# EAGLE design smdpractice_ledmarquee (EAGLE 5.11)
PROJECT: LED MARQUEE BOARD v1.0
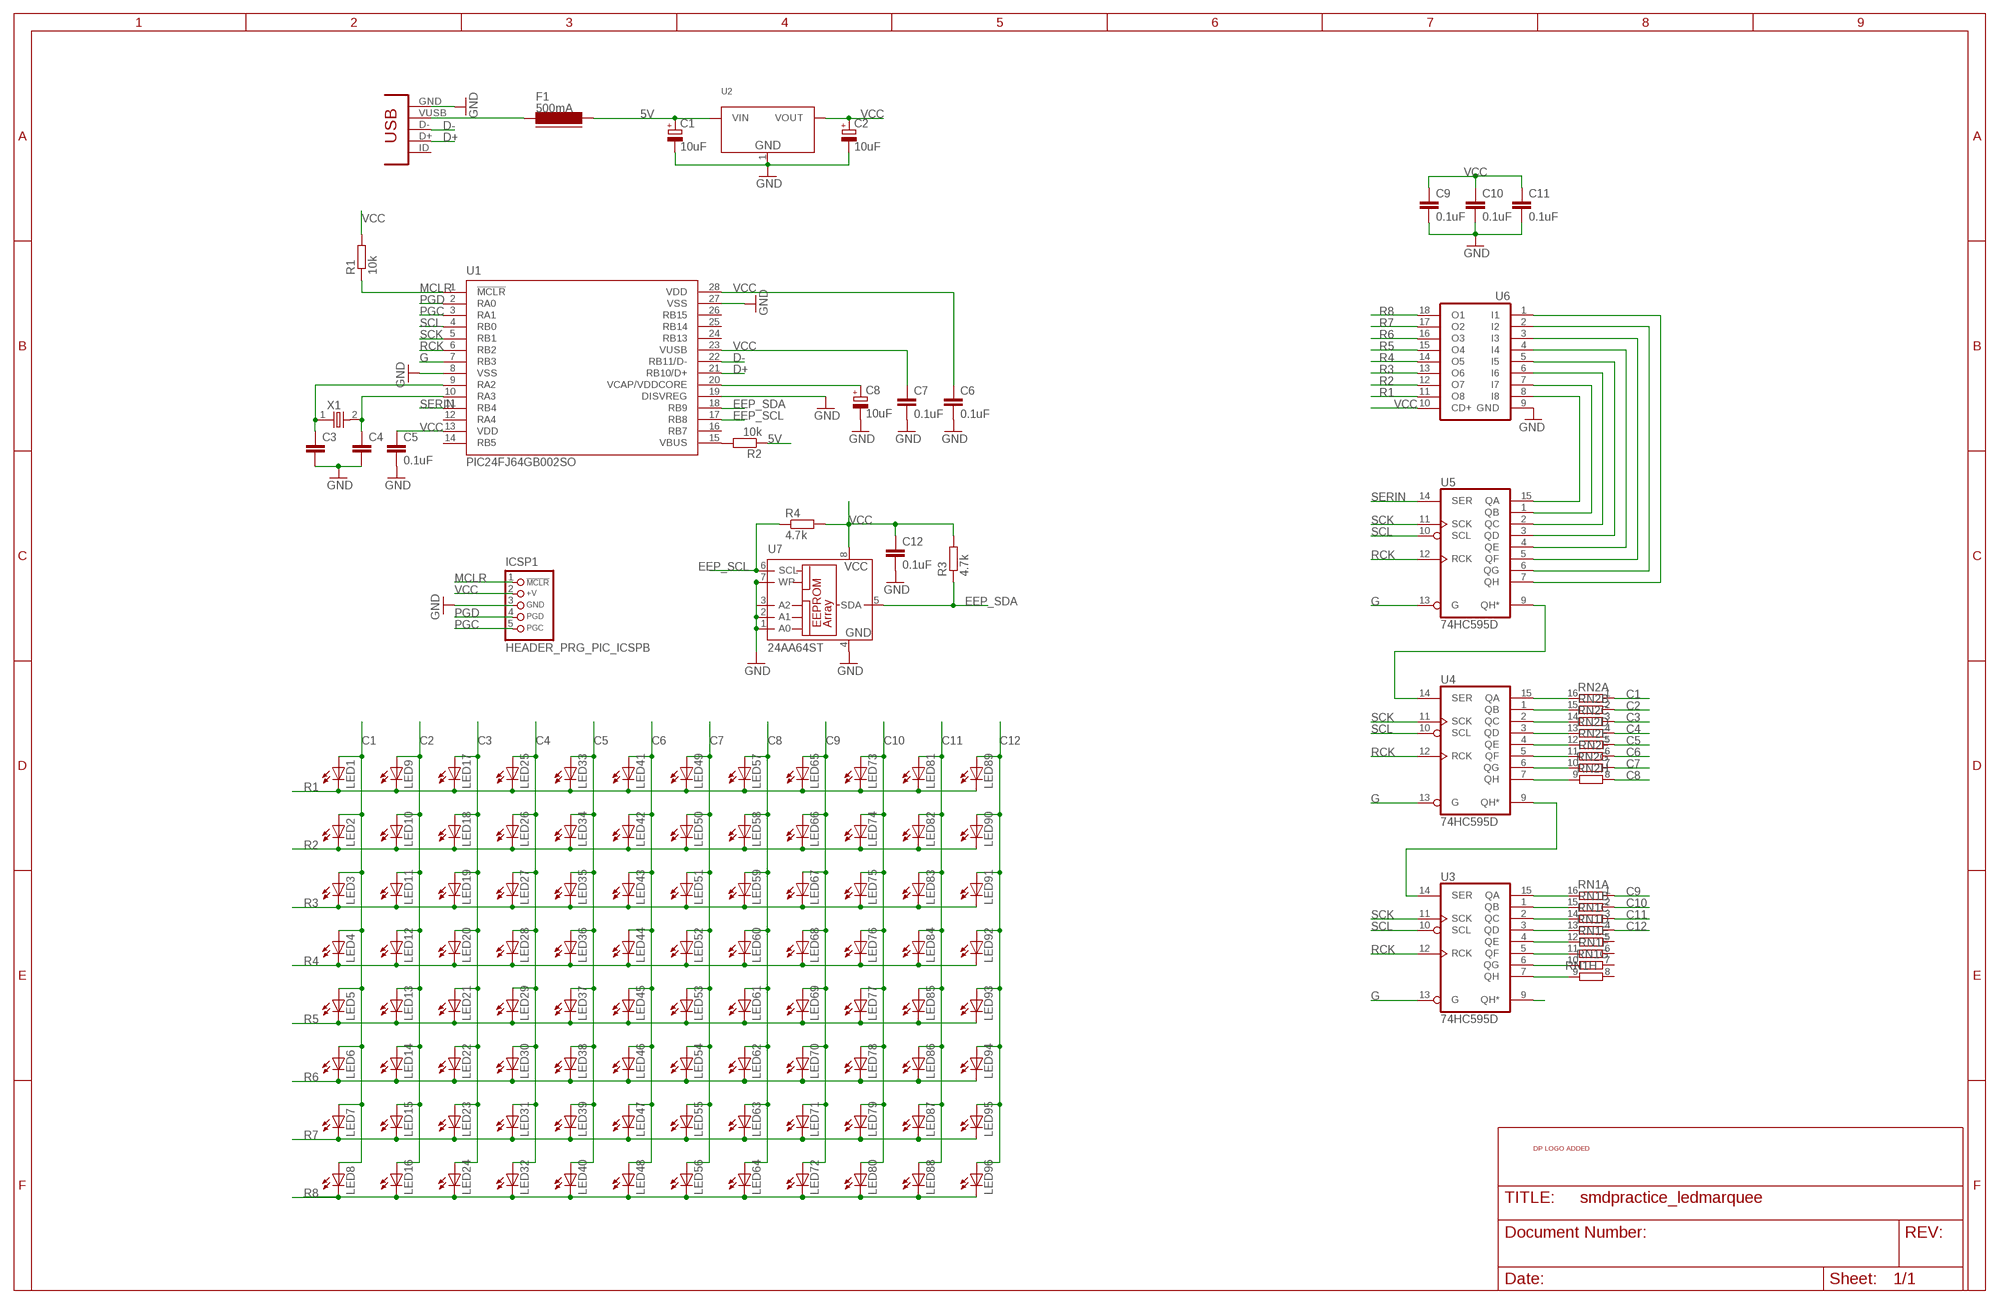
[diagram p0: schematic, sheet 1]

## Parts
C1  10uF  CAP_POLSMC_A  [SMC_A]
C2  10uF  CAP_POLSMC_A  [SMC_A]
C3  CAPC1206  [C1206]
C4  CAPC1206  [C1206]
C5  0.1uF  CAPC1206  [C1206]
C6  0.1uF  CAPC1206  [C1206]
C7  0.1uF  CAPC1206  [C1206]
C8  10uF  CAP_POLSMC_A  [SMC_A]
C9  0.1uF  CAPC1206  [C1206]
C10  0.1uF  CAPC1206  [C1206]
C11  0.1uF  CAPC1206  [C1206]
C12  0.1uF  CAPC1206  [C1206]
F1  500mA  FERRITE_BEAD1206  [FB1206]
ICSP1  HEADER_PRG_PIC_ICSPB  [HEADER_PRG_1X05_ICSP_B]
J1  CON-USB-MINI-BUSB1  [CONN_USB_MINI-B]
LED1  LEDCHIPLED_1206  [CHIPLED_1206]
LED2  LEDCHIPLED_1206  [CHIPLED_1206]
LED3  LEDCHIPLED_1206  [CHIPLED_1206]
LED4  LEDCHIPLED_1206  [CHIPLED_1206]
LED5  LEDCHIPLED_1206  [CHIPLED_1206]
LED6  LEDCHIPLED_1206  [CHIPLED_1206]
LED7  LEDCHIPLED_1206  [CHIPLED_1206]
LED8  LEDCHIPLED_1206  [CHIPLED_1206]
LED9  LEDCHIPLED_1206  [CHIPLED_1206]
LED10  LEDCHIPLED_1206  [CHIPLED_1206]
LED11  LEDCHIPLED_1206  [CHIPLED_1206]
LED12  LEDCHIPLED_1206  [CHIPLED_1206]
LED13  LEDCHIPLED_1206  [CHIPLED_1206]
LED14  LEDCHIPLED_1206  [CHIPLED_1206]
LED15  LEDCHIPLED_1206  [CHIPLED_1206]
LED16  LEDCHIPLED_1206  [CHIPLED_1206]
LED17  LEDCHIPLED_1206  [CHIPLED_1206]
LED18  LEDCHIPLED_1206  [CHIPLED_1206]
LED19  LEDCHIPLED_1206  [CHIPLED_1206]
LED20  LEDCHIPLED_1206  [CHIPLED_1206]
LED21  LEDCHIPLED_1206  [CHIPLED_1206]
LED22  LEDCHIPLED_1206  [CHIPLED_1206]
LED23  LEDCHIPLED_1206  [CHIPLED_1206]
LED24  LEDCHIPLED_1206  [CHIPLED_1206]
LED25  LEDCHIPLED_1206  [CHIPLED_1206]
LED26  LEDCHIPLED_1206  [CHIPLED_1206]
LED27  LEDCHIPLED_1206  [CHIPLED_1206]
LED28  LEDCHIPLED_1206  [CHIPLED_1206]
LED29  LEDCHIPLED_1206  [CHIPLED_1206]
LED30  LEDCHIPLED_1206  [CHIPLED_1206]
LED31  LEDCHIPLED_1206  [CHIPLED_1206]
LED32  LEDCHIPLED_1206  [CHIPLED_1206]
LED33  LEDCHIPLED_1206  [CHIPLED_1206]
LED34  LEDCHIPLED_1206  [CHIPLED_1206]
LED35  LEDCHIPLED_1206  [CHIPLED_1206]
LED36  LEDCHIPLED_1206  [CHIPLED_1206]
LED37  LEDCHIPLED_1206  [CHIPLED_1206]
LED38  LEDCHIPLED_1206  [CHIPLED_1206]
LED39  LEDCHIPLED_1206  [CHIPLED_1206]
LED40  LEDCHIPLED_1206  [CHIPLED_1206]
LED41  LEDCHIPLED_1206  [CHIPLED_1206]
LED42  LEDCHIPLED_1206  [CHIPLED_1206]
LED43  LEDCHIPLED_1206  [CHIPLED_1206]
LED44  LEDCHIPLED_1206  [CHIPLED_1206]
LED45  LEDCHIPLED_1206  [CHIPLED_1206]
LED46  LEDCHIPLED_1206  [CHIPLED_1206]
LED47  LEDCHIPLED_1206  [CHIPLED_1206]
LED48  LEDCHIPLED_1206  [CHIPLED_1206]
LED49  LEDCHIPLED_1206  [CHIPLED_1206]
LED50  LEDCHIPLED_1206  [CHIPLED_1206]
LED51  LEDCHIPLED_1206  [CHIPLED_1206]
LED52  LEDCHIPLED_1206  [CHIPLED_1206]
LED53  LEDCHIPLED_1206  [CHIPLED_1206]
LED54  LEDCHIPLED_1206  [CHIPLED_1206]
LED55  LEDCHIPLED_1206  [CHIPLED_1206]
LED56  LEDCHIPLED_1206  [CHIPLED_1206]
LED57  LEDCHIPLED_1206  [CHIPLED_1206]
LED58  LEDCHIPLED_1206  [CHIPLED_1206]
LED59  LEDCHIPLED_1206  [CHIPLED_1206]
LED60  LEDCHIPLED_1206  [CHIPLED_1206]
LED61  LEDCHIPLED_1206  [CHIPLED_1206]
LED62  LEDCHIPLED_1206  [CHIPLED_1206]
LED63  LEDCHIPLED_1206  [CHIPLED_1206]
LED64  LEDCHIPLED_1206  [CHIPLED_1206]
LED65  LEDCHIPLED_1206  [CHIPLED_1206]
LED66  LEDCHIPLED_1206  [CHIPLED_1206]
LED67  LEDCHIPLED_1206  [CHIPLED_1206]
LED68  LEDCHIPLED_1206  [CHIPLED_1206]
LED69  LEDCHIPLED_1206  [CHIPLED_1206]
LED70  LEDCHIPLED_1206  [CHIPLED_1206]
LED71  LEDCHIPLED_1206  [CHIPLED_1206]
LED72  LEDCHIPLED_1206  [CHIPLED_1206]
LED73  LEDCHIPLED_1206  [CHIPLED_1206]
LED74  LEDCHIPLED_1206  [CHIPLED_1206]
LED75  LEDCHIPLED_1206  [CHIPLED_1206]
LED76  LEDCHIPLED_1206  [CHIPLED_1206]
LED77  LEDCHIPLED_1206  [CHIPLED_1206]
LED78  LEDCHIPLED_1206  [CHIPLED_1206]
LED79  LEDCHIPLED_1206  [CHIPLED_1206]
LED80  LEDCHIPLED_1206  [CHIPLED_1206]
LED81  LEDCHIPLED_1206  [CHIPLED_1206]
LED82  LEDCHIPLED_1206  [CHIPLED_1206]
LED83  LEDCHIPLED_1206  [CHIPLED_1206]
LED84  LEDCHIPLED_1206  [CHIPLED_1206]
LED85  LEDCHIPLED_1206  [CHIPLED_1206]
LED86  LEDCHIPLED_1206  [CHIPLED_1206]
LED87  LEDCHIPLED_1206  [CHIPLED_1206]
LED88  LEDCHIPLED_1206  [CHIPLED_1206]
LED89  LEDCHIPLED_1206  [CHIPLED_1206]
LED90  LEDCHIPLED_1206  [CHIPLED_1206]
LED91  LEDCHIPLED_1206  [CHIPLED_1206]
LED92  LEDCHIPLED_1206  [CHIPLED_1206]
LED93  LEDCHIPLED_1206  [CHIPLED_1206]
LED94  LEDCHIPLED_1206  [CHIPLED_1206]
LED95  LEDCHIPLED_1206  [CHIPLED_1206]
LED96  LEDCHIPLED_1206  [CHIPLED_1206]
R1  10k  RESISTORR1206  [R1206]
R2  10k  RESISTORR1206  [R1206]
R3  4.7k  RESISTORR1206  [R1206]
R4  4.7k  RESISTORR1206  [R1206]
RN1  470  RNETWORK_8  [CAT16-F8/CAT16-J8]
RN2  470  RNETWORK_8  [CAT16-F8/CAT16-J8]
U1  PIC24FJ64GB002SO  [SOIC28W]
U2  LD1117-3.3SOT223  [SOT223]
U3  74HC595D  [SO16]
U4  74HC595D  [SO16]
U5  74HC595D  [SO16]
U6  ULN2803ADW  [SO18L]
U7  24AA64ST  [TSSOP8]
U$1  DP_LOGO  [DP_LOGO]
X1  OSC-XTAL  [HC-49U]

## Nets
5V: C1.+ F1.2 R2.1 U2.3(VIN)
C1: LED1.A LED2.A LED3.A LED4.A LED5.A LED6.A LED7.A LED8.A RN2.1
C2: LED9.A LED10.A LED11.A LED12.A LED13.A LED14.A LED15.A LED16.A RN2.2
C3: LED17.A LED18.A LED19.A LED20.A LED21.A LED22.A LED23.A LED24.A RN2.3
C4: LED25.A LED26.A LED27.A LED28.A LED29.A LED30.A LED31.A LED32.A RN2.4
C5: LED33.A LED34.A LED35.A LED36.A LED37.A LED38.A LED39.A LED40.A RN2.5
C6: LED41.A LED42.A LED43.A LED44.A LED45.A LED46.A LED47.A LED48.A RN2.6
C7: LED49.A LED50.A LED51.A LED52.A LED53.A LED54.A LED55.A LED56.A RN2.7
C8: LED57.A LED58.A LED59.A LED60.A LED61.A LED62.A LED63.A LED64.A RN2.8
C9: LED65.A LED66.A LED67.A LED68.A LED69.A LED70.A LED71.A LED72.A RN1.1
C10: LED73.A LED74.A LED75.A LED76.A LED77.A LED78.A LED79.A LED80.A RN1.2
C11: LED81.A LED82.A LED83.A LED84.A LED85.A LED86.A LED87.A LED88.A RN1.3
C12: LED89.A LED90.A LED91.A LED92.A LED93.A LED94.A LED95.A LED96.A RN1.4
D+: J1.D+ U1.21(RB10/D+)
D-: J1.D- U1.22(RB11/D-)
EEP_SCL: R4.1 U1.17(RB8) U7.6(SCL)
EEP_SDA: R3.1 U1.18(RB9) U7.5(SDA)
G: U1.7(RB3) U3.13(G) U4.13(G) U5.13(G)
GND: C1.- C2.- C3.2 C4.2 C5.2 C6.2 C7.2 C8.- C9.2 C10.2 C11.2 C12.2 ICSP1.3(GND) J1.GND U1.8(VSS) U1.19(DISVREG) U1.27(VSS) U2.1(GND) U6.9(GND) U7.1(A0) U7.2(A1) U7.3(A2) U7.4(GND) U7.7(WP)
MCLR: ICSP1.1(/MCLR) R1.1 U1.1(!MCLR)
N$1: RN1.16 U3.15(QA)
N$2: RN1.15 U3.1(QB)
N$3: RN1.14 U3.2(QC)
N$4: RN1.13 U3.3(QD)
N$5: RN1.12 U3.4(QE)
N$6: RN1.11 U3.5(QF)
N$7: RN1.10 U3.6(QG)
N$8: RN1.9 U3.7(QH)
N$9: RN2.16 U4.15(QA)
N$10: RN2.15 U4.1(QB)
N$11: RN2.14 U4.2(QC)
N$12: RN2.13 U4.3(QD)
N$13: RN2.12 U4.4(QE)
N$14: RN2.11 U4.5(QF)
N$15: RN2.10 U4.6(QG)
N$16: RN2.9 U4.7(QH)
N$17: U4.14(SER) U5.9(QH*)
N$18: C3.1 U1.9(RA2) X1.1
N$19: C4.1 U1.10(RA3) X1.2
N$20: U3.14(SER) U4.9(QH*)
N$21: R2.2 U1.15(VBUS)
N$22: C8.+ U1.20(VCAP/VDDCORE)
N$23: F1.1 J1.VUSB
N$25: U3.9(QH*)
N$40: U5.15(QA) U6.8(I8)
N$41: U5.1(QB) U6.7(I7)
N$42: U5.2(QC) U6.6(I6)
N$45: U5.5(QF) U6.3(I3)
N$46: U5.6(QG) U6.2(I2)
N$47: U5.7(QH) U6.1(I1)
N$51: U5.4(QE) U6.4(I4)
N$52: U5.3(QD) U6.5(I5)
PGC: ICSP1.5(PGC) U1.3(RA1)
PGD: ICSP1.4(PGD) U1.2(RA0)
R1: LED1.C LED9.C LED17.C LED25.C LED33.C LED41.C LED49.C LED57.C LED65.C LED73.C LED81.C LED89.C U6.11(O8)
R2: LED2.C LED10.C LED18.C LED26.C LED34.C LED42.C LED50.C LED58.C LED66.C LED74.C LED82.C LED90.C U6.12(O7)
R3: LED3.C LED11.C LED19.C LED27.C LED35.C LED43.C LED51.C LED59.C LED67.C LED75.C LED83.C LED91.C U6.13(O6)
R4: LED4.C LED12.C LED20.C LED28.C LED36.C LED44.C LED52.C LED60.C LED68.C LED76.C LED84.C LED92.C U6.14(O5)
R5: LED5.C LED13.C LED21.C LED29.C LED37.C LED45.C LED53.C LED61.C LED69.C LED77.C LED85.C LED93.C U6.15(O4)
R6: LED6.C LED14.C LED22.C LED30.C LED38.C LED46.C LED54.C LED62.C LED70.C LED78.C LED86.C LED94.C U6.16(O3)
R7: LED7.C LED15.C LED23.C LED31.C LED39.C LED47.C LED55.C LED63.C LED71.C LED79.C LED87.C LED95.C U6.17(O2)
R8: LED8.C LED16.C LED24.C LED32.C LED40.C LED48.C LED56.C LED64.C LED72.C LED80.C LED88.C LED96.C U6.18(O1)
RCK: U1.6(RB2) U3.12(RCK) U4.12(RCK) U5.12(RCK)
SCK: U1.5(RB1) U3.11(SCK) U4.11(SCK) U5.11(SCK)
SCL: U1.4(RB0) U3.10(SCL) U4.10(SCL) U5.10(SCL)
SERIN: U1.11(RB4) U5.14(SER)
VCC: C2.+ C5.1 C6.1 C7.1 C9.1 C10.1 C11.1 C12.1 ICSP1.2(+V) R1.2 R3.2 R4.2 U1.13(VDD) U1.23(VUSB) U1.28(VDD) U2.2(VOUT) U6.10(CD+) U7.8(VCC)
Unconnected: J1.BODY@1(BODY) J1.BODY@2(BODY) J1.BODY@3(BODY) J1.BODY@4(BODY) J1.ID(USBID) RN1.5 RN1.6 RN1.7 RN1.8 U1.12(RA4) U1.14(RB5) U1.16(RB7) U1.24(RB13) U1.25(RB14) U1.26(RB15)

## Power pins joined to a net without a drawn wire
GND: U3.8(GND) U4.8(GND) U5.8(GND)
VCC: U3.16(VCC) U4.16(VCC) U5.16(VCC)

## Library data of the parts
C1 C2 C8 = dp_devices:CAP_POL
C3-C7 C9-C12 = dp_devices:CAP
F1 = dp_devices - Copy:FERRITE_BEAD
ICSP1 = dp_devices:HEADER_PRG_PIC_ICSP: 5-pin PIC In Circuit Serial Programming header
J1 = dp_devices:CON-USB-MINI-B: USB connector
LED1-LED96 = led:LED: LED OSRAM: - CHIPLED LG R971, LG N971, LY N971, LG Q971, LY Q971, LO R971, LY R971 LH N974, LH R974 LS Q976, LO Q976, LY Q976 LO Q996 - Hyper CHIPLED LW Q18S LB Q993, LB Q99A, LB R99A - SideLED LS A670, LO A670, LY A670, LG A670, LP A670 LB A673, LV A673, LT A673, LW A673 LH A674 LY A675 LS A676, LA A676, LO A676, LY A676, LW A676 LS A679, LY A679, LG A679 - Hyper Micro SIDELED® LS Y876, LA Y876, LO Y876, LY Y876 LT Y87S - SmartLED LW L88C, LW L88S LB L89C, LB L89S, LG L890 LS L89K, LO L89K, LY L89K LS L896, LA L896, LO L896, LY L896 - TOPLED LS T670, LO T670, LY T670, LG T670, LP T670 LSG T670, LSP T670, LSY T670, LOP T670, LYG T670 LG T671, LOG T671, LSG T671 LB T673, LV T673, LT T673, LW T673 LH T674 LS T676, LA T676, LO T676, LY T676, LB T676, LH T676, LSB T676, LW T676 LB T67C, LV T67C, LT T67C, LS T67K, LO T67K, LY T67K, LW E67C LS E67B, LA E67B, LO E67B, LY E67B, LB E67C, LV E67C, LT E67C LW T67C LS T679, LY T679, LG T679 LS T770, LO T770, LY T770, LG T770, LP T770 LB T773, LV T773, LT T773, LW T773 LH T774 LS E675, LA E675, LY E675, LS T675 LS T776, LA T776, LO T776, LY T776, LB T776 LHGB T686 LT T68C, LB T68C - Hyper Mini TOPLED® LB M676 - Mini TOPLED Santana® LG M470 LS M47K, LO M47K, LY M47K Source: http://www.osram.convergy.de LUXEON: - LUMILED® LXK2-PW12-R00, LXK2-PW12-S00, LXK2-PW14-U00, LXK2-PW14-V00 LXK2-PM12-R00, LXK2-PM12-S00, LXK2-PM14-U00 LXK2-PE12-Q00, LXK2-PE12-R00, LXK2-PE12-S00, LXK2-PE14-T00, LXK2-PE14-U00 LXK2-PB12-K00, LXK2-PB12-L00, LXK2-PB12-M00, LXK2-PB14-N00, LXK2-PB14-P00, LXK2-PB14-Q00 LXK2-PR12-L00, LXK2-PR12-M00, LXK2-PR14-Q00, LXK2-PR14-R00 LXK2-PD12-Q00, LXK2-PD12-R00, LXK2-PD12-S00 LXK2-PH12-R00, LXK2-PH12-S00 LXK2-PL12-P00, LXK2-PL12-Q00, LXK2-PL12-R00 Source: www.luxeon.com KINGBRIGHT: KA-3528ASYC Source: www.kingbright.com
R1-R4 = dp_devices:RESISTOR
RN1 RN2 = dp_devices - Copy:RNETWORK_8
U1 = dp_devices - Copy:PIC24FJ64GB002: PIC24FJ64GA002 edit this description Auto generated by make-symbol-device-package-bsdl.ulp Rev. 25 Source: PIC24FJ64GA002.bsd
U2 = dp_devices:LD1117-3.3
U3-U5 = 74xx-eu:74*595: 8-bit SHIFT REGISTER, output latch
U6 = dp_devices:ULN2803A: DRIVER ARRAY
U7 = microchip:24*: Serial EEPROM I2C; MPN: 25AA640A-I/ST; OC_FARNELL: 1818513; OC_NEWARK: 27M1300
U$1 = dp_devices:DP_LOGO; FF1: fullfillment by; FF2: Seeed studio; FF3: www.seeedstudio.com; LICENSE: CC-BY-SA; PROJECT: project; URL1: http://; URL2: DangerousPrototypes.com
X1 = dp_devices:OSC-XTAL

## Board
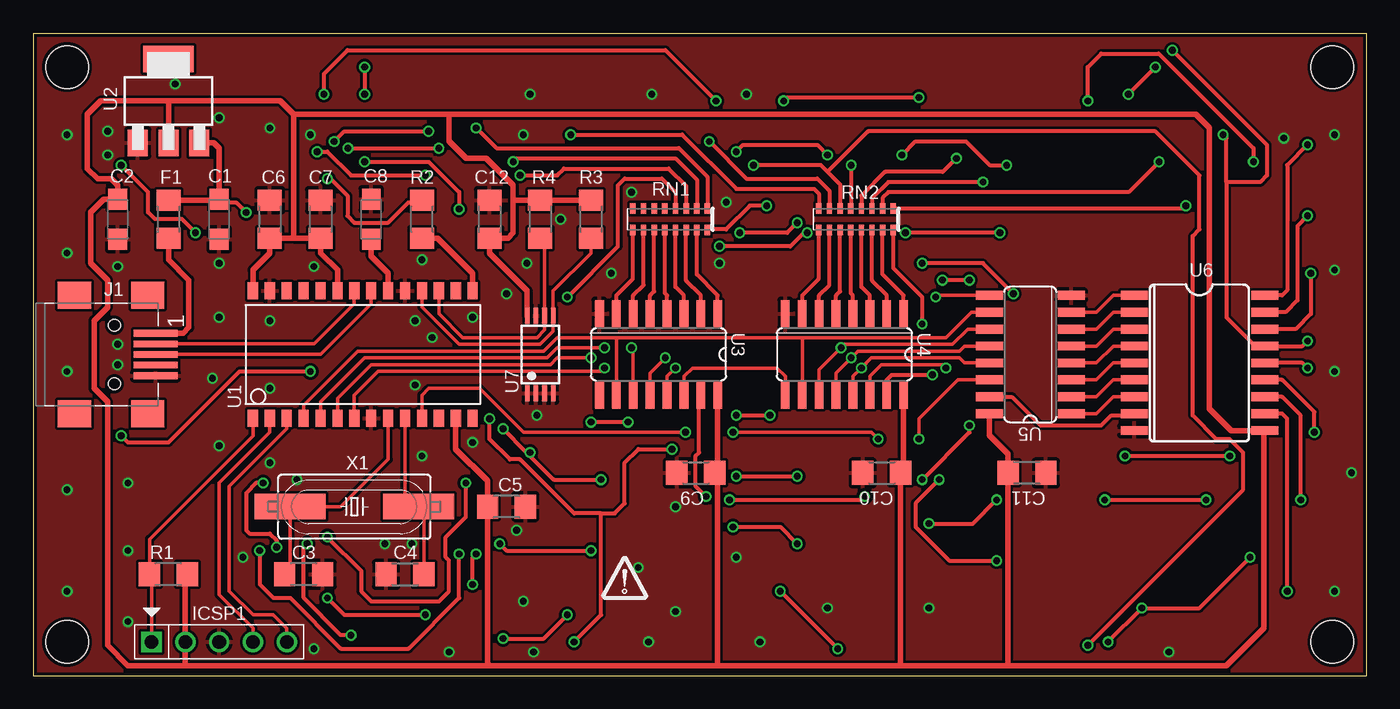
[diagram p1: board, top side]
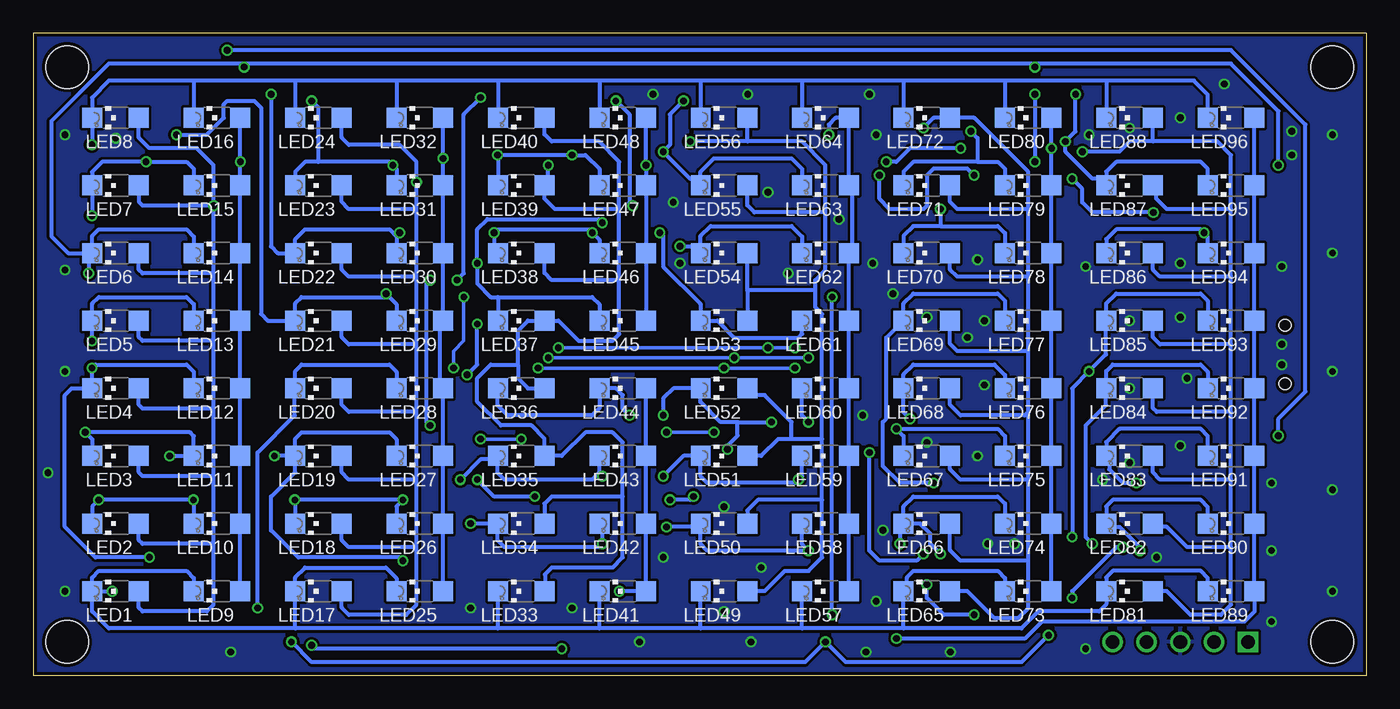
[diagram p2: board, bottom side, seen from below]

Size 100.17 x 48.26 mm. Coordinates in mm from the lower left corner, seen from the top.
Outline: 0,0 100.17,0 100.17,48.26 0,48.26 0,0
Copper layers (1*16): Top 0.035mm / dielectric 1.5mm / Bottom 0.035mm
Design rules "Fusion_eagle_rule_v1.1": minimum track width 6mil, minimum drill 12mil, track to track 6mil, track to pad 6mil, pad to pad 6mil, via to via 6mil, smd to smd 0mil, copper to edge 10mil, drill to drill 10mil, minimum pad ring 10mil, minimum via ring 6mil, stop-mask expansion 2mil, vias tented up to drill 100mil, thermal gap 10mil
Holes 3.2 mm at 2.54,2.54 97.63,2.54 97.63,45.72 2.54,45.72

### Footprints (pad centres in the part's own frame; a part is rotated, then mirrored left to right if it is on the bottom)
SMC_A = smd 1.6 x 1.4: + -1.5,0; - 1.5,0
C1206 = smd 1.6 x 1.803: 1 -1.422,0; 2 1.422,0
FB1206 = smd 1.6 x 1.803: 1 -1.422,0; 2 1.422,0
HEADER_PRG_1X05_ICSP_B = drill 1.016 square: 1 -5.08,0 | drill 1.016 round: 2 -2.54,0; 3 0,0; 4 2.54,0; 5 5.08,0
CONN_USB_MINI-B = smd 2 x 2.5: BODY@1 -4.45,2.5; BODY@2 4.45,2.5; BODY@3 4.45,-3; BODY@4 -4.45,-3 | smd 0.5 x 3.3: D+ 0,3.1; D- -0.8,3.1; GND 1.6,3.1; ID 0.8,3.1; VUSB -1.6,3.1 | hole 0.9: -2.2,0; 2.2,0
CHIPLED_1206 = smd 1.5 x 1.5: A 0,-1.75; C 0,1.75
R1206 = smd 1.6 x 1.803: 1 -1.422,0; 2 1.422,0
CAT16-F8/CAT16-J8 = smd 0.4 x 0.8: 1 -2.4,-0.8; 2 -1.6,-0.8; 3 -0.8,-0.8; 4 0,-0.8; 5 0.8,-0.8; 6 1.6,-0.8; 7 2.4,-0.8; 8 3.2,-0.8; 9 3.2,0.8; 10 2.4,0.8; 11 1.6,0.8; 12 0.8,0.8; 13 0,0.8; 14 -0.8,0.8; 15 -1.6,0.8; 16 -2.4,0.8
SOIC28W = smd 0.762 x 1.27: 1 -8.89,-4.78; 2 -7.62,-4.78; 3 -6.35,-4.78; 4 -5.08,-4.78; 5 -3.81,-4.78; 6 -2.54,-4.78; 7 -1.27,-4.78; 8 0,-4.78; 9 1.27,-4.78; 10 2.54,-4.78; 11 3.81,-4.78; 12 5.08,-4.78; 13 6.35,-4.78; 14 7.62,-4.78; 15 7.62,4.78; 16 6.35,4.78; 17 5.08,4.78; 18 3.81,4.78; 19 2.54,4.78; 20 1.27,4.78; 21 0,4.78; 22 -1.27,4.78; 23 -2.54,4.78; 24 -3.81,4.78; 25 -5.08,4.78; 26 -6.35,4.78; 27 -7.62,4.78; 28 -8.89,4.78
SOT223 = smd 1.5 x 2: 1 -2.3,-3.15; 2 0,-3.15; 3 2.3,-3.15 | smd 3.8 x 2: 4 0,3.15
SO16 = smd 0.66 x 2.032: 1 -4.445,-3.073; 2 -3.175,-3.073; 3 -1.905,-3.073; 4 -0.635,-3.073; 5 0.635,-3.073; 6 1.905,-3.073; 7 3.175,-3.073; 8 4.445,-3.073; 9 4.445,3.073; 10 3.175,3.073; 11 1.905,3.073; 12 0.635,3.073; 13 -0.635,3.073; 14 -1.905,3.073; 15 -3.175,3.073; 16 -4.445,3.073
SO18L = smd 0.66 x 2.032: 1 -0.635,-4.902; 2 0.635,-4.902; 3 1.905,-4.902; 4 3.175,-4.902; 5 4.445,-4.902; 6 5.715,-4.902; 7 6.985,-4.902; 8 8.255,-4.902; 9 9.525,-4.902; 10 9.525,4.902; 11 8.255,4.902; 12 6.985,4.902; 13 5.715,4.902; 14 4.445,4.902; 15 3.175,4.902; 16 1.905,4.902; 17 0.635,4.902; 18 -0.635,4.902
TSSOP8 = smd 0.35 x 1.2: 1 -0.975,-2.925; 2 -0.325,-2.925; 3 0.325,-2.925; 4 0.975,-2.925; 5 0.975,2.925; 6 0.325,2.925; 7 -0.325,2.925; 8 -0.975,2.925
HC-49U = smd 5.334 x 1.93: 1 -4.826,0; 2 4.826,0

### Placement (x,y rotation side)
C1  13.97,34.29 270 top
C2  6.35,34.29 270 top
C3  20.32,7.62 0 top
C4  27.94,7.62 180 top
C5  35.56,12.7 0 top
C6  17.78,34.29 90 top
C7  21.59,34.29 90 top
C8  25.4,34.29 90 top
C9  49.78,15.24 180 top
C10  63.75,15.24 180 top
C11  74.68,15.24 0 top
C12  34.29,34.29 90 top
F1  10.16,34.29 90 top
ICSP1  13.97,2.54 0 top
J1  6.1,24.13 270 top
LED1  93.98,6.35 90 bottom
LED2  93.98,11.43 90 bottom
LED3  93.98,16.51 90 bottom
LED4  93.98,21.59 90 bottom
LED5  93.98,26.67 90 bottom
LED6  93.98,31.75 90 bottom
LED7  93.98,36.83 90 bottom
LED8  93.98,41.91 90 bottom
LED9  86.36,6.35 90 bottom
LED10  86.36,11.43 90 bottom
LED11  86.36,16.51 90 bottom
LED12  86.36,21.59 90 bottom
LED13  86.36,26.67 90 bottom
LED14  86.36,31.75 90 bottom
LED15  86.36,36.83 90 bottom
LED16  86.36,41.91 90 bottom
LED17  78.74,6.35 90 bottom
LED18  78.74,11.43 90 bottom
LED19  78.74,16.51 90 bottom
LED20  78.74,21.59 90 bottom
LED21  78.74,26.67 90 bottom
LED22  78.74,31.75 90 bottom
LED23  78.74,36.83 90 bottom
LED24  78.74,41.91 90 bottom
LED25  71.12,6.35 90 bottom
LED26  71.12,11.43 90 bottom
LED27  71.12,16.51 90 bottom
LED28  71.12,21.59 90 bottom
LED29  71.12,26.67 90 bottom
LED30  71.12,31.75 90 bottom
LED31  71.12,36.83 90 bottom
LED32  71.12,41.91 90 bottom
LED33  63.5,6.35 90 bottom
LED34  63.5,11.43 90 bottom
LED35  63.5,16.51 90 bottom
LED36  63.5,21.59 90 bottom
LED37  63.5,26.67 90 bottom
LED38  63.5,31.75 90 bottom
LED39  63.5,36.83 90 bottom
LED40  63.5,41.91 90 bottom
LED41  55.88,6.35 90 bottom
LED42  55.88,11.43 90 bottom
LED43  55.88,16.51 90 bottom
LED44  55.88,21.59 90 bottom
LED45  55.88,26.67 90 bottom
LED46  55.88,31.75 90 bottom
LED47  55.88,36.83 90 bottom
LED48  55.88,41.91 90 bottom
LED49  48.26,6.35 90 bottom
LED50  48.26,11.43 90 bottom
LED51  48.26,16.51 90 bottom
LED52  48.26,21.59 90 bottom
LED53  48.26,26.67 90 bottom
LED54  48.26,31.75 90 bottom
LED55  48.26,36.83 90 bottom
LED56  48.26,41.91 90 bottom
LED57  40.64,6.35 90 bottom
LED58  40.64,11.43 90 bottom
LED59  40.64,16.51 90 bottom
LED60  40.64,21.59 90 bottom
LED61  40.64,26.67 90 bottom
LED62  40.64,31.75 90 bottom
LED63  40.64,36.83 90 bottom
LED64  40.64,41.91 90 bottom
LED65  33.02,6.35 90 bottom
LED66  33.02,11.43 90 bottom
LED67  33.02,16.51 90 bottom
LED68  33.02,21.59 90 bottom
LED69  33.02,26.67 90 bottom
LED70  33.02,31.75 90 bottom
LED71  33.02,36.83 90 bottom
LED72  33.02,41.91 90 bottom
LED73  25.4,6.35 90 bottom
LED74  25.4,11.43 90 bottom
LED75  25.4,16.51 90 bottom
LED76  25.4,21.59 90 bottom
LED77  25.4,26.67 90 bottom
LED78  25.4,31.75 90 bottom
LED79  25.4,36.83 90 bottom
LED80  25.4,41.91 90 bottom
LED81  17.78,6.35 90 bottom
LED82  17.78,11.43 90 bottom
LED83  17.78,16.51 90 bottom
LED84  17.78,21.59 90 bottom
LED85  17.78,26.67 90 bottom
LED86  17.78,31.75 90 bottom
LED87  17.78,36.83 90 bottom
LED88  17.78,41.91 90 bottom
LED89  10.16,6.35 90 bottom
LED90  10.16,11.43 90 bottom
LED91  10.16,16.51 90 bottom
LED92  10.16,21.59 90 bottom
LED93  10.16,26.67 90 bottom
LED94  10.16,31.75 90 bottom
LED95  10.16,36.83 90 bottom
LED96  10.16,41.91 90 bottom
R1  10.16,7.62 0 top
R2  29.21,34.29 270 top
R3  41.91,34.29 90 top
R4  38.1,34.29 90 top
RN1  48.26,34.29 180 top
RN2  62.23,34.29 180 top
U1  25.4,24.13 0 top
U2  10.16,43.18 0 top
U3  46.99,24.13 180 top
U4  60.96,24.13 180 top
U5  74.93,24.13 90 top
U6  87.63,27.94 270 top
U7  38.1,24.13 0 top
U$1  44.45,6.35 0 top
X1  24.13,12.7 0 top

### Tracks (layer width: path | path; a pad name or v marks a point on that pad's centre or on a via)
5V  (via drill 0.51)
  Top 0.305: v16,34.8 15.24,35.56 14.22,35.56 13.97,35.81 13.97,36.07 | R2.1 29.21,35.56 28.19,35.56 26.67,34.04 24.13,34.04 23.62,34.54 23.62,36.07 22.35,37.34 v22.1,37.34
  Top 0.406: F1.2 13.89,35.71 C1.+ 13.97,35.81 13.97,39.62 13.56,40.03 U2.3
  Bottom 0.305: v22.1,37.34 21.34,36.58 21.34,35.56 20.57,34.8 v16,34.8
C1  (via drill 0.51)
  Top 0.305: RN2.1 86.4,35.09 v86.61,35.31
  Bottom 0.305: LED8.A 92.23,40.41 91.44,39.62 87.88,39.62 86.61,38.35 v86.61,35.31 | LED7.A 92.2,36.8 92.2,35.56 91.95,35.31 v86.61,35.31 | 86.61,9.91 86.61,14.99 | 86.61,14.99 86.61,20.07 | 86.61,20.07 86.61,25.15 | 86.61,25.15 86.61,30.23 | LED6.A 92.23,30.51 91.95,30.23 86.61,30.23 | LED5.A 92.23,25.43 91.95,25.15 86.61,25.15 | LED4.A 92.23,20.35 91.95,20.07 86.61,20.07 | LED3.A 92.23,15.27 91.95,14.99 86.61,14.99 | LED2.A 92.23,10.19 91.95,9.91 86.61,9.91 | 86.61,9.91 86.61,5.33 87.12,4.83 91.95,4.83 92.23,5.11 LED1.A | 86.61,30.23 v86.61,35.31
C2  (via drill 0.51)
  Top 0.305: RN2.2 63.83,35.89 64.26,36.32 82.32,36.32 v84.61,38.61
  Bottom 0.305: LED9.A LED10.A LED11.A 84.61,21.11 84.84,21.34 | 84.84,21.34 85.09,21.59 | 84.61,36.35 LED14.A LED13.A LED12.A 84.84,21.59 84.84,21.34 | 84.61,36.35 85.09,36.83 | LED16.A v84.61,38.61 LED15.A 84.61,36.35
C3  (via drill 0.51)
  Top 0.305: RN2.3 63.03,35.85 64.26,37.08 v71.37,37.08
  Bottom 0.305: LED24.A 76.99,40.41 76.45,39.88 72.64,39.88 71.37,38.61 v71.37,37.08 71.37,35.05 | 71.37,9.65 71.37,5.33 72.14,4.57 76.45,4.57 76.99,5.11 LED17.A | 71.37,9.65 71.37,14.73 | 71.37,14.73 71.37,19.81 | 71.37,19.81 71.37,24.89 | 71.37,24.89 71.37,29.97 | 71.37,29.97 71.37,35.05 | LED18.A 76.99,10.19 76.45,9.65 71.37,9.65 | LED19.A 76.99,15.27 76.45,14.73 71.37,14.73 | LED20.A 76.99,20.35 76.45,19.81 71.37,19.81 | LED21.A 76.99,25.43 76.45,24.89 71.37,24.89 | LED22.A 76.99,30.51 76.45,29.97 71.37,29.97 | LED23.A 76.99,35.59 76.45,35.05 71.37,35.05
C4  (via drill 0.51)
  Top 0.305: RN2.4 62.23,36.07 64.01,37.85 68.35,37.85 v69.37,38.86
  Bottom 0.305: LED25.A LED26.A LED27.A LED28.A 69.6,21.82 69.6,26.67 LED29.A LED30.A LED31.A v69.37,38.86 LED32.A
C5  (via drill 0.51)
  Top 0.305: RN2.5 61.43,38.32 v61.47,38.35
  Bottom 0.305: LED40.A 61.75,40.67 61.21,40.13 57.66,40.13 56.13,38.61 56.13,35.05 | 56.13,29.72 56.13,25.65 56.64,25.15 59.18,25.15 60.71,26.67 LED37.A 62.99,26.67 63.75,25.91 63.75,23.37 | 56.13,29.72 56.13,35.05 | LED38.A 61.75,30.25 61.21,29.72 56.13,29.72 | 56.13,35.05 60.96,35.05 61.75,35.84 LED39.A 61.47,37.11 v61.47,38.35 | LED36.A 62.99,21.59 63.75,22.35 63.75,23.37 | 63.75,23.37 65.79,23.37 66.8,22.35 66.8,20.57 65.02,18.8 62.74,18.8 61.75,17.81 LED35.A 60.45,16.51 58.67,18.29 56.64,18.29 55.88,17.53 55.88,13.46 | 55.88,13.46 55.88,8.89 56.64,8.13 61.21,8.13 61.72,7.62 61.72,6.38 LED33.A | LED34.A 61.75,12.93 61.21,13.46 55.88,13.46
C6  (via drill 0.51)
  Top 0.305: RN2.6 60.63,36.91 59.69,37.85 | 59.69,37.85 59.18,38.35 v54.13,38.35 | v56.13,6.35 v60.45,2.03 | v79.25,2.29 90.93,13.97 90.93,16.76 89.92,17.78 88.9,17.78 87.12,19.56 87.12,33.02 87.63,33.53 87.63,37.59 84.33,40.89 62.74,40.89 59.69,37.85
  Bottom 0.305: LED48.A v54.13,38.35 LED47.A LED46.A LED45.A | LED44.A LED43.A LED42.A LED41.A v56.13,6.35 | v60.45,2.03 78.99,2.03 v79.25,2.29
C7  (via drill 0.51)
  Top 0.305: RN2.7 59.83,36.44 58.93,37.34 53.59,37.34 v50.8,40.13
  Bottom 0.305: 40.89,13.21 40.89,8.89 41.91,7.87 43.69,7.87 45.21,6.35 LED49.A | 40.64,34.8 40.64,38.35 42.42,40.13 46.48,40.13 | LED50.A 46.51,12.42 45.72,13.21 40.89,13.21 | 46.51,28.93 LED53.A | 46.51,28.93 46.48,28.96 41.4,28.96 | 46.51,28.93 LED54.A | LED55.A 46.51,35.33 45.97,34.8 40.64,34.8 | 46.48,40.13 v50.8,40.13 | LED56.A 46.51,40.16 46.48,40.13 | 40.89,13.21 40.89,17.78 | 40.89,17.78 40.89,27.18 41.4,27.69 41.4,28.96 | 41.4,28.96 41.4,29.72 40.64,30.48 40.64,34.8 | LED52.A 46.51,21.11 46.48,21.08 45.21,21.08 43.18,19.05 43.18,17.78 | LED51.A 45.47,16.51 44.2,17.78 43.18,17.78 | 40.89,17.78 43.18,17.78
C8  (via drill 0.51)
  Top 0.305: RN2.8 59.03,36.22 58.67,36.58 52.83,36.58 48.77,40.64 v40.39,40.64
  Bottom 0.305: LED57.A 38.89,10.95 | 38.89,10.95 39.37,11.43 | 38.89,10.95 LED58.A LED59.A LED60.A LED61.A LED62.A 38.86,31.75 38.61,32 38.61,36.55 LED63.A LED64.A 39.88,41.91 40.39,41.4 v40.39,40.64
C9  (via drill 0.51)
  Top 0.305: RN1.1 50.66,37.48 48.51,39.62 34.8,39.62 v33.27,41.15
  Bottom 0.305: 25.4,8.64 25.4,5.08 26.16,4.32 27.94,4.32 29.97,6.35 LED65.A | 25.4,8.64 25.4,14.73 | 25.4,14.73 25.4,19.81 | 25.4,19.81 25.4,24.38 | 25.4,24.38 25.4,29.97 | 25.4,29.97 25.4,35.05 | 25.4,35.05 25.4,37.85 29.46,41.91 LED72.A 32.51,41.91 v33.27,41.15 | LED66.A 31.27,9.43 30.48,8.64 25.4,8.64 | LED67.A 31.27,15.52 30.48,14.73 25.4,14.73 | LED68.A 31.27,20.35 30.48,19.56 25.65,19.56 25.4,19.81 | LED69.A 31.27,24.92 30.73,24.38 25.4,24.38 | LED70.A 31.27,30.51 30.73,29.97 25.4,29.97 | LED71.A 31.27,35.59 30.73,35.05 25.4,35.05
C10  (via drill 0.51)
  Top 0.305: RN1.2 49.86,37.26 48.26,38.86 36.32,38.86 v36.07,38.61 | v23.65,39.62 v30.48,39.62
  Bottom 0.305: LED80.A v23.65,39.62 LED79.A LED78.A LED77.A LED76.A LED75.A LED74.A LED73.A | v36.07,38.61 35.31,38.61 34.29,39.62 v30.48,39.62
C11  (via drill 0.51)
  Top 0.305: RN1.3 49.06,36.79 47.75,38.1 39.88,38.1 39.37,37.59 v36.58,37.59 | v29.46,37.59 23.88,37.59 22.1,39.37 v21.34,39.37
  Bottom 0.305: 10.16,9.65 10.16,5.33 10.92,4.57 13.21,4.57 14.99,6.35 LED81.A | 10.16,9.65 10.16,14.73 | 10.16,14.73 10.16,19.81 | 10.16,19.81 10.16,24.89 | 10.16,24.89 10.16,29.97 | 10.16,29.97 10.16,35.05 | 10.16,35.05 10.16,39.12 11.18,40.13 16,40.13 | LED83.A 16.03,15.27 15.49,14.73 10.16,14.73 | LED84.A 16.03,20.09 15.75,19.81 10.16,19.81 | LED85.A 16.03,25.43 15.49,24.89 10.16,24.89 | LED86.A 16.03,30.51 15.49,29.97 10.16,29.97 | LED87.A 15.75,36.83 15.78,36.8 15.78,35.84 14.99,35.05 10.16,35.05 | v36.58,37.59 36.58,35.81 35.81,35.05 33.27,35.05 33.02,35.31 33.02,37.59 32.51,38.1 29.97,38.1 v29.46,37.59 | v21.34,39.37 18.54,39.37 17.78,40.13 16,40.13 | LED88.A 16.03,40.16 16,40.13 | 10.16,9.65 13.46,9.65 14.99,11.18 15.78,11.18 LED82.A
C12  (via drill 0.51)
  Top 0.305: RN1.4 48.26,36.32 47.24,37.34 44.45,37.34 43.94,36.83 43.94,32.26 v40.13,28.45 | v35.31,2.79 38.35,2.79 v40.13,4.57
  Bottom 0.305: LED96.A LED95.A LED94.A LED93.A 8.41,22.07 8.89,21.59 LED92.A LED91.A LED90.A LED89.A 8.38,6.32 8.38,4.83 9.14,4.06 24.38,4.06 25.65,2.79 v35.31,2.79 | v40.13,4.57 v40.13,28.45
D+
  Top 0.254: J1.D+ 21.59,24.13 25.4,27.94 U1.21
D-
  Top 0.254: J1.D- 21.12,24.93 24.13,27.94 U1.22
EEP_SCL
  Top 0.254: R4.1 38.42,32.54 U7.6 38.42,25.98 37.85,25.4 32.26,25.4 30.48,27.18 U1.17
EEP_SDA
  Top 0.254: R3.1 41.91,31.75 39.08,28.91 U7.5 39.08,25.87 38.1,24.89 32,24.89 29.21,27.69 U1.18
G  (via drill 0.51)
  Top 0.254: U4.13 61.59,22.48 v62.23,23.11 | v62.23,23.11 62.61,23.5 | U3.13 47.62,22.48 v48.26,23.11 | U1.7 24.13,21.08 25.91,22.86 42.67,22.86 v42.93,23.11 | U5.13 69.98,23.5 69.6,23.88 62.99,23.88 v62.23,23.11
  Bottom 0.254: v62.23,23.11 v48.26,23.11 v42.93,23.11
GND  (via drill 0.51)
  other vias: 2.54,6.35 97.79,40.64 97.79,6.35 6.35,24.89 6.35,23.37 2.54,22.86 2.54,13.97 2.54,31.75 2.54,40.64 97.79,30.48 97.79,22.86 93.98,40.39 99.06,15.24 85.34,1.78 59.69,5.08 67.31,5.08 54.61,2.54 52.83,8.89 48.26,12.7 29.97,25.4 7.11,4.06 7.11,9.4 7.11,14.48 13.97,30.99 13.97,26.92 17.78,26.67 17.78,21.59 13.97,17.27 5.59,40.89 5.59,39.12 13.97,41.91 10.67,44.45 20.83,40.64 17.78,41.15 35.56,28.7 37.08,30.99 39.62,34.29 43.43,30.23 51.56,30.99 44.96,36.32 52.07,35.56 46.48,43.69 53.59,43.69 37.85,19.56 28.7,21.84 37.34,43.69 36.83,40.64 33.02,17.53 29.21,16.51 29.21,31.24 28.7,26.67 33.02,26.92 19.81,14.73 17.78,16 21.08,30.73 15.75,8.89 45.47,8.13 48.26,4.83 46.23,2.54 36.32,10.92 37.59,1.78 28.45,9.91 26.42,9.91 31.24,1.78 36.83,5.59 21.08,2.03 13.46,22.35 6.35,30.73
  pour Bottom (isolate 0.203): 0,48.26 100.17,48.26 100.17,0 0,0
  pour Top (isolate 0.203): 0,48.26 100.17,48.26 100.17,0 0,0
MCLR
  Top 0.254: U1.1 16.51,18.03 8.74,10.26 R1.1 8.89,7.47 ICSP1.1
N$1  (via drill 0.51)
  Top 0.305: v55.12,35.31 53.85,35.31 52.07,33.53 50.8,33.53 RN1.16 | v56.39,43.18 56.64,43.43 v66.55,43.43 | v70.36,29.72 v68.33,29.72 | v70.36,18.8 70.36,18.29 v66.8,14.73 | v62.48,13.46 62.23,13.21 v52.32,13.21 | v50.55,13.46 49.78,14.22 49.78,16.51 50.04,16.76 50.04,20.83 U3.15
  Bottom 0.305: v55.12,35.31 55.37,35.56 55.37,42.16 v56.39,43.18 | v66.55,43.43 67.82,42.16 67.82,30.23 v68.33,29.72 | v70.36,29.72 70.61,29.46 70.61,19.05 v70.36,18.8 | v66.8,14.73 65.53,13.46 v62.48,13.46 | v52.32,13.21 50.8,13.21 v50.55,13.46
N$2
  Top 0.305: RN1.15 49.86,30.15 51.44,28.57 U3.1
N$3
  Top 0.305: RN1.14 49.06,29.68 50.16,28.57 U3.2
N$4
  Top 0.305: RN1.13 48.26,29.21 48.9,28.57 U3.3
N$5
  Top 0.305: U3.4 47.62,28.57 47.46,28.74 RN1.12
N$6
  Top 0.305: RN1.11 46.66,28.88 46.35,28.57 U3.5
N$7
  Top 0.305: RN1.10 45.86,29.35 45.09,28.57 U3.6
N$8
  Top 0.305: RN1.9 45.06,29.82 43.81,28.57 U3.7
N$9  (via drill 0.51)
  Top 0.305: RN2.16 64.63,30.62 66.8,28.45 v66.8,26.42 | v67.56,22.61 64.52,22.61 64.14,22.23 U4.15
  Bottom 0.305: v67.56,22.61 66.8,23.37 v66.8,26.42
N$10
  Top 0.305: RN2.15 63.83,30.15 65.41,28.57 U4.1
N$11
  Top 0.305: RN2.14 63.03,29.68 64.14,28.57 U4.2
N$12
  Top 0.305: RN2.13 62.23,29.21 62.87,28.57 U4.3
N$13
  Top 0.305: RN2.12 61.43,28.74 61.59,28.57 U4.4
N$14
  Top 0.305: RN2.11 60.63,28.88 60.33,28.57 U4.5
N$15
  Top 0.305: RN2.10 59.83,29.35 59.05,28.57 U4.6
N$16
  Top 0.305: RN2.9 59.03,29.82 57.78,28.57 U4.7
N$17  (via drill 0.51)
  Top 0.254: U4.14 62.87,22.48 63.75,23.37 68.33,23.37 v68.58,23.11 | v67.82,28.45 67.94,28.57 U5.9
  Bottom 0.254: v68.58,23.11 68.58,24.38 67.82,25.15 v67.82,28.45
N$18
  Top 0.254: U1.9 26.67,16.26 23.11,12.7 19.81,12.7 | 19.81,12.7 X1.1 | C3.1 19.05,7.62 19.3,7.87 19.3,12.19 19.81,12.7
N$19
  Top 0.254: U1.10 27.94,13.72 X1.2 29.36,12.29 C4.1
N$20
  Top 0.254: U3.14 48.9,22.48 49.53,23.11 55.88,23.11 56.52,22.48 U4.9
N$21
  Top 0.406: U1.15 33.02,30.23 30.38,32.87 R2.2
N$22
  Top 0.406: U1.20 26.67,30.23 25.4,31.5 C8.+
N$23
  Top 0.406: J1.VUSB 11.25,25.73 11.68,26.16 11.68,29.72 10.16,31.24 F1.1
N$40
  Top 0.305: U5.15 73.53,20.95 75.69,18.8 80.26,18.8 81.03,19.56 82.6,19.56 U6.8
N$41
  Top 0.254: U5.1 79.88,19.68 81.15,20.95 U6.7
N$42
  Top 0.254: U5.2 79.88,20.95 81.15,22.23 U6.6
N$45
  Top 0.254: U5.5 79.88,24.77 81.15,26.04 U6.3
N$46
  Top 0.254: U5.6 79.88,26.04 81.15,27.3 U6.2
N$47
  Top 0.254: U5.7 79.88,27.3 81.15,28.57 U6.1
N$51
  Top 0.254: U5.4 79.88,23.5 81.15,24.77 U6.4
N$52
  Top 0.254: U5.3 79.88,22.23 81.15,23.5 U6.5
PGC
  Top 0.254: U1.3 19.05,18.54 14.73,14.22 14.73,6.35 16.51,4.57 18.03,4.57 19.05,3.56 ICSP1.5
PGD
  Top 0.254: U1.2 17.78,18.29 13.97,14.48 13.97,6.1 16.51,3.56 ICSP1.4
R1  (via drill 0.51)
  Top 0.305: U6.11 93.85,19.68 94.23,19.3 v94.23,6.35
  Bottom 0.305: LED1.C v94.23,6.35 | LED9.C 88.11,7.34 88.65,7.87 95.25,7.87 95.76,7.37 95.76,6.38 LED1.C | LED89.C 11.91,7.34 12.45,7.87 19.05,7.87 19.53,7.39 LED81.C 19.53,5.36 20.07,4.83 24.64,4.83 25.91,3.56 34.77,3.56 | LED73.C 27.15,7.34 27.69,7.87 34.04,7.87 34.52,7.39 34.52,6.38 34.54,6.35 LED65.C 34.77,3.56 | 80.49,3.56 94.49,3.56 95.76,4.83 95.76,6.32 LED1.C | 80.49,3.56 LED17.C 80.49,7.39 79.76,8.13 73.66,8.13 72.87,7.34 LED25.C | 34.77,3.56 42.39,3.56 | 50.01,3.56 57.63,3.56 | 65.25,3.56 80.49,3.56 | 57.63,3.56 LED41.C | 65.25,3.56 LED33.C | 57.63,3.56 65.25,3.56 | 42.39,3.56 LED57.C | 50.01,3.56 LED49.C | 42.39,3.56 50.01,3.56
R2  (via drill 0.51)
  Top 0.305: U6.12 93.85,20.95 95.25,19.56 v95.25,13.21 | v80.52,13.21 v88.14,13.21 | v67.31,11.43 70.61,11.43 v72.39,13.21 | v52.58,11.18 56.13,11.18 v57.4,9.91 | v32,9.14 32,5.84 28.19,2.03 23.11,2.03 19.3,5.84 18.03,5.84 17.02,6.86 v17.02,9.4 | v41.91,9.4 35.56,9.4 v35.05,9.91
  Bottom 0.305: LED2.C 95.73,12.73 v95.25,13.21 v88.14,13.21 88.11,13.18 LED10.C | 65.28,11.4 65.28,10.16 64.77,9.65 57.66,9.65 v57.4,9.91 57.4,11.2 LED42.C | 65.28,11.4 LED34.C | LED90.C 11.91,12.67 12.45,13.21 19.05,13.21 19.53,12.73 LED82.C 19.56,11.18 18.54,11.18 17.02,9.65 v17.02,9.4 | LED74.C 27.15,12.93 27.69,13.46 34.04,13.46 34.77,12.73 LED66.C | 50.04,11.18 50.04,9.91 49.53,9.4 v41.91,9.4 42.39,9.88 LED58.C | 50.04,11.18 50.04,11.4 LED50.C 50.04,11.18 | LED18.C 80.49,13.18 v80.52,13.21 v72.39,13.21 72.87,12.73 LED26.C | 65.28,11.4 67.28,11.4 v67.31,11.43 | 50.04,11.18 v52.58,11.18 | v35.05,9.91 35.05,11.18 34.8,11.43 | LED66.C 34.8,11.43 | 34.8,11.43 34.8,11.94 | LED66.C 33.53,11.43 32.77,10.67 32.77,9.91 v32,9.14
R3  (via drill 0.51)
  Top 0.305: U6.13 93.85,22.23 96.27,19.81 v96.27,18.29 | v82.04,16.51 v89.92,16.51 | v52.83,14.99 v57.4,14.99 | v42.67,14.73 39.12,14.73 37.08,16.76 | 37.08,16.76 v35.31,18.54 | v17.27,14.48 16.76,14.48 16,13.72 16,10.92 16.26,10.67 17.78,10.67 18.29,10.16 v18.29,9.65 | v22.1,5.84 23.37,4.57 v29.46,4.57 | v33.02,6.86 33.02,8.89 v33.27,9.14 | v37.34,16.76 37.08,16.76 | v72.39,8.64 68.83,8.64 66.29,11.18 66.29,12.95 v68.07,14.73
  Bottom 0.305: LED3.C 95.73,17.75 v96.27,18.29 88.39,18.29 88.11,18.01 LED11.C v89.92,16.51 | LED27.C 72.87,17.75 73.41,18.29 80.01,18.29 80.49,17.81 LED19.C | LED43.C 57.63,15.27 57.66,15.24 | 57.66,15.24 58.17,14.73 64.77,14.73 65.28,15.24 65.28,16.26 | 65.28,16.26 65.28,16.48 LED35.C 65.28,16.26 | LED91.C 11.91,18.01 12.45,18.54 18.54,18.54 19.53,17.55 LED83.C | LED75.C 27.15,18.01 27.69,18.54 v35.31,18.54 34.77,18.01 LED67.C | LED59.C 42.39,15.01 v42.67,14.73 42.93,14.48 49.53,14.48 50.04,14.99 50.04,16.48 LED51.C 51.31,16.51 v52.83,14.99 | v57.4,14.99 57.66,15.24 | v18.29,9.65 18.8,9.65 22.1,6.35 v22.1,5.84 | v29.46,4.57 31.75,4.57 33.02,5.84 v33.02,6.86 | LED83.C 19.3,16.51 | v72.39,8.64 72.64,8.89 80.26,8.89 82.3,10.92 82.3,13.46 80.49,15.27 LED19.C | v68.07,14.73 66.55,16.26 65.28,16.26 | LED19.C v82.04,16.51 | v17.27,14.48 18.29,14.48 19.3,15.49 19.3,16.28 LED83.C | v37.34,16.76 37.34,9.4 36.58,8.64 33.78,8.64 v33.27,9.14
R4  (via drill 0.51)
  Top 0.305: U6.14 95.38,23.5 v95.76,23.11 | v91.44,8.89 87.63,5.08 v83.31,5.08 v80.77,2.54 | v52.83,19.56 v55.37,19.56 | v20.57,9.91 20.32,9.65 20.32,5.84 23.11,3.05 v23.88,3.05 | v40.64,2.54 42.67,4.57 42.67,12.19 | v34.29,19.3 34.29,17.78 35.81,16.26 36.58,16.26 40.64,12.19 42.67,12.19 | v44.7,19.05 v41.91,19.05 | v48.01,17.02 45.47,17.02 44.45,16 44.45,12.95 43.69,12.19 42.67,12.19
  Bottom 0.305: LED12.C 88.11,22.83 88.65,23.37 95.5,23.37 v95.76,23.11 95.76,21.62 LED4.C 97.28,21.59 97.79,21.08 97.79,11.18 95.5,8.89 v91.44,8.89 | LED28.C 72.87,22.83 73.41,23.37 80.01,23.37 80.49,22.89 LED20.C 80.52,21.59 80.52,19.56 83.31,16.76 v83.31,5.08 | LED36.C 65.28,21.56 65.28,20.32 64.52,19.56 58.17,19.56 57.63,20.09 LED44.C 56.39,21.59 55.88,21.08 55.88,20.07 v55.37,19.56 | LED92.C 11.91,22.83 12.45,23.37 19.05,23.37 19.53,22.89 LED84.C 19.56,21.59 19.56,20.32 21.08,18.8 21.08,10.41 v20.57,9.91 | LED76.C 27.15,22.58 27.94,23.37 34.04,23.37 34.77,22.63 LED68.C 34.77,19.78 v34.29,19.3 | 47.24,19.05 v44.7,19.05 | 47.24,19.05 48.51,19.05 50.04,20.57 50.04,21.56 LED52.C 52.07,21.59 52.83,20.83 v52.83,19.56 | v23.88,3.05 25.91,1.02 39.12,1.02 v40.64,2.54 42.16,1.02 79.25,1.02 v80.77,2.54 | 47.24,19.05 47.24,18.03 48.01,17.27 v48.01,17.02 | v41.91,19.05 42.42,19.56 42.42,21.56 LED60.C
R5  (via drill 0.51)
  Top 0.305: v95.76,25.15 95.38,24.77 U6.15 92.46,24.89 91.69,24.89 89.66,26.92 89.66,37.08 | v22.1,10.41 24.64,7.87 24.64,6.35 25.4,5.59 30.48,5.59 31.24,6.35 31.24,8.64 30.99,8.89 30.99,10.41 32.51,11.94 v32.51,14.48 | v53.09,33.27 56.64,33.27 v57.4,34.04 | v73.66,28.7 71.37,30.99 v66.8,30.99 | 89.66,37.08 89.66,40.39 v89.41,40.64 | v20.83,22.86 15.49,22.86 10.16,17.53 7.11,17.53 v6.6,18.03 | v85.6,46.99 92.71,39.88 92.71,37.59 92.2,37.08 89.66,37.08
  Bottom 0.305: v95.76,25.15 95.76,26.64 LED5.C 95.73,27.97 | LED13.C 88.11,27.91 88.65,28.45 95.25,28.45 95.73,27.97 | 95.73,27.97 95.76,27.94 | LED29.C 72.87,27.91 73.41,28.45 73.66,28.45 | 73.66,28.45 80.01,28.45 80.49,27.97 LED21.C 82.55,26.67 83.06,27.18 83.06,42.67 83.57,43.18 85.6,43.18 85.85,42.93 85.85,41.91 87.12,40.64 v89.41,40.64 | LED45.C 57.63,27.91 58.17,28.45 65.28,28.45 | LED93.C 11.91,28.17 12.45,28.7 18.8,28.7 19.53,27.97 LED85.C 19.56,26.67 19.56,24.13 v20.83,22.86 22.1,21.59 v22.1,10.41 | LED77.C 27.15,28.17 27.69,28.7 34.04,28.7 34.77,27.97 LED69.C 34.8,26.67 36.07,25.4 36.07,19.3 36.32,19.05 36.32,15.75 35.05,14.48 v32.51,14.48 | LED61.C 42.39,25.68 42.67,25.4 47.5,25.4 48.77,26.67 LED53.C 50.04,26.67 50.04,27.94 52.83,30.73 52.83,33.02 v53.09,33.27 | 73.66,28.45 v73.66,28.7 | v66.8,30.99 67.06,30.99 | v6.6,18.03 6.6,19.3 4.57,21.34 4.57,41.4 10.16,46.99 v85.6,46.99 | v66.8,30.99 66.8,33.53 66.04,34.29 57.66,34.29 v57.4,34.04 | 65.28,28.45 65.79,28.45 66.8,29.46 v66.8,30.99 | LED37.C 65.25,28.42 65.28,28.45
R6  (via drill 0.51)
  Top 0.305: U6.16 94.87,26.04 96.01,27.18 v96.01,30.23 | v32,35.05 32,36.32 29.72,38.61 v24.89,38.61 | v24.89,45.72 v24.89,43.69 | v6.6,38.35 8.64,36.32 8.64,34.8 9.14,34.29 11.18,34.29 v12.19,33.27 | v72.64,33.27 v65.53,33.27 | v58.17,33.27 57.91,33.27 56.9,32.26 v51.56,32.26 | v84.33,45.72 v82.3,43.69
  Bottom 0.305: v96.01,30.23 96.01,31.72 LED6.C | LED14.C 88.11,32.99 88.65,33.53 95.25,33.53 95.73,33.05 LED6.C | LED30.C 72.87,32.99 72.9,33.02 | 72.9,33.02 73.41,33.53 79.76,33.53 80.49,32.79 LED22.C 81.79,31.75 82.3,32.26 v82.3,43.69 | LED94.C 11.91,32.99 v12.19,33.27 12.45,33.53 18.8,33.53 19.53,32.79 LED86.C | LED78.C 27.15,33.25 27.69,33.78 32,33.78 | 32,33.78 34.04,33.78 34.77,33.05 LED70.C | LED62.C 42.39,32.99 43.18,33.78 49.28,33.78 50.01,33.05 LED54.C 50.04,32.26 v51.56,32.26 | v32,35.05 32,33.78 | v24.89,43.69 v24.89,38.61 | v6.6,38.35 6.6,42.42 10.16,45.97 24.64,45.97 v24.89,45.72 25.15,45.97 84.58,45.97 | 72.9,33.02 v72.64,33.27 | 84.58,45.97 94.49,45.97 98.81,41.66 98.81,33.02 97.54,31.75 LED6.C | 84.58,45.97 v84.33,45.72 | LED38.C 65.53,32.03 v65.53,33.27 65.28,33.53 58.42,33.53 v58.17,33.27 57.63,32.74 LED46.C
R7  (via drill 0.51)
  Top 0.305: U6.17 94.11,27.3 95,28.19 95,33.78 v95.76,34.54 | v22.61,40.13 23.37,40.89 v29.72,40.89 | v73.15,38.35 71.88,38.35 70.1,40.13 66.29,40.13 v65.28,39.12 | v59.69,39.12 58.93,39.88 53.34,39.88 v52.83,39.37 | v51.31,43.18 47.5,46.99 23.62,46.99 21.84,45.21 v21.84,43.69 | v91.69,38.61 91.69,39.62 84.58,46.74 80.26,46.74 79.25,45.72 v79.25,43.18
  Bottom 0.305: v95.76,34.54 95.76,36.8 LED7.C 95.76,36.86 95.76,37.85 95,38.61 v91.69,38.61 88.65,38.61 88.11,38.07 LED15.C | LED31.C 72.87,38.07 v73.15,38.35 73.41,38.61 78.74,38.61 | 78.74,38.61 79.76,38.61 80.49,37.87 LED23.C | LED95.C 11.91,38.07 12.45,38.61 18.8,38.61 19.53,37.87 LED87.C 19.56,37.34 20.57,37.34 22.61,39.37 v22.61,40.13 21.84,40.89 v21.84,43.69 | LED79.C 27.15,38.07 27.69,38.61 29.21,38.61 | 29.21,38.61 34.04,38.61 34.77,37.87 LED71.C | LED63.C 42.39,38.07 43.18,38.86 49.02,38.86 50.01,37.87 LED55.C 50.04,37.34 50.8,37.34 v52.83,39.37 52.32,39.88 52.32,42.16 v51.31,43.18 | v79.25,43.18 78.74,42.67 78.74,38.61 | v29.72,40.89 29.21,40.39 29.21,38.61 | LED39.C 65.25,39.09 v65.28,39.12 v59.69,39.12 58.67,39.12 57.63,38.07 LED47.C
R8  (via drill 0.51)
  Top 0.305: U6.18 93.85,28.57 94.23,28.96 94.23,38.35 v95.76,39.88
  Bottom 0.305: v95.76,39.88 95.76,41.88 LED8.C 95.76,41.94 95.76,43.43 94.49,44.7 88.14,44.7 | LED96.C 11.91,43.66 12.95,44.7 19.53,44.7 | 19.53,44.7 27.15,44.7 | 80.49,44.7 88.14,44.7 | LED16.C 88.11,44.68 88.14,44.7 | 80.49,44.7 LED24.C | 72.87,44.7 80.49,44.7 | 72.87,44.7 LED32.C | 65.25,44.7 72.87,44.7 | 65.25,44.7 LED40.C | 57.63,44.7 65.25,44.7 | 57.63,44.7 LED48.C | 50.01,44.7 57.63,44.7 | 50.01,44.7 LED56.C | 42.39,44.7 50.01,44.7 | 42.39,44.7 LED64.C | 34.77,44.7 42.39,44.7 | 34.77,44.7 LED72.C | 27.15,44.7 LED80.C | 27.15,44.7 34.77,44.7 | 19.53,44.7 LED88.C
RCK  (via drill 0.51)
  Top 0.254: U5.12 69.98,24.77 69.6,24.38 61.98,24.38 v61.47,23.88 60.33,22.73 U4.12 | U3.12 46.35,22.73 v47.5,23.88 | U1.6 22.86,20.83 25.4,23.37 38.86,23.37 39.37,23.88 v41.91,23.88
  Bottom 0.254: v61.47,23.88 v47.5,23.88 v41.91,23.88
SCK  (via drill 0.51)
  Top 0.254: U4.11 59.05,22.99 v60.71,24.64 60.96,24.89 69.09,24.89 70.23,26.04 U5.11 | U3.11 45.09,24.51 v44.96,24.64 | U1.5 21.59,20.57 24.89,23.88 38.61,23.88 39.37,24.64 v42.93,24.64
  Bottom 0.254: v60.71,24.64 v44.96,24.64 v42.93,24.64
SCL
  Top 0.254: U5.10 70.48,27.3 68.58,25.4 57.78,25.4 | 57.78,25.4 U4.10 | U1.4 20.32,20.32 24.38,24.38 38.35,24.38 39.37,25.4 43.81,25.4 | 43.81,25.4 U3.10 | 43.81,25.4 57.78,25.4
SERIN  (via drill 0.51)
  Top 0.254: U1.11 29.21,21.08 29.72,21.59 33.53,21.59 36.83,18.29 v49.02,18.29 | v52.58,18.29 62.99,18.29 v63.5,17.78 | v66.55,17.78 66.55,19.3 69.47,22.23 U5.14
  Bottom 0.254: v49.02,18.29 v52.58,18.29 | v63.5,17.78 v66.55,17.78
VCC
  Top 0.406: U1.28 16.51,30.48 17.78,31.75 C6.1 19.56,32.87 | U1.23 22.86,30.48 21.59,31.75 C7.1 19.56,32.87 | U7.8 37.12,28.91 34.29,31.75 C12.1 35.66,32.87 36.07,33.27 36.07,35.81 | 51.44,15.47 U3.16 | 51.44,15.47 C9.1 | U4.16 65.41,15.47 C10.1 65.18,0.86 65.28,0.76 | U5.16 71.86,18.06 73.25,16.66 C11.1 73.25,0.86 73.15,0.76 | U1.13 31.75,17.02 34.14,14.63 C5.1 34.14,0.91 34.29,0.76 | C2.+ 6.33,35.81 | R3.2 R4.2 36.17,35.71 36.07,35.81 | 10.16,43.18 18.54,43.18 19.56,42.16 | 19.56,42.16 19.56,32.87 | C2.+ 6.35,36.83 5.84,37.34 4.83,37.34 4.06,38.1 4.06,42.16 5.08,43.18 10.16,43.18 | C2.+ 5.31,35.79 4.32,34.8 4.32,30.99 5.59,29.72 5.59,27.69 4.57,26.67 4.57,21.59 5.59,20.57 5.59,2.29 7.11,0.76 11.43,0.76 | R1.2 11.43,7.47 ICSP1.2 11.43,0.76 | 11.43,0.76 34.29,0.76 | 34.29,0.76 51.31,0.76 | 51.31,0.76 65.28,0.76 | 65.28,0.76 73.15,0.76 | 51.44,15.47 51.44,0.89 51.31,0.76 | 19.56,42.16 31.24,42.16 | 31.24,42.16 87.38,42.16 88.39,41.15 88.39,20.07 90.04,18.41 U6.10 | 73.15,0.76 89.66,0.76 92.46,3.56 92.46,18.54 | 10.16,43.18 U2.2 | 36.07,35.81 36.07,36.83 34.04,38.86 32.51,38.86 31.24,40.13 31.24,42.16